# EAGLE design outin_shield_zunda (EAGLE 7.3.0)
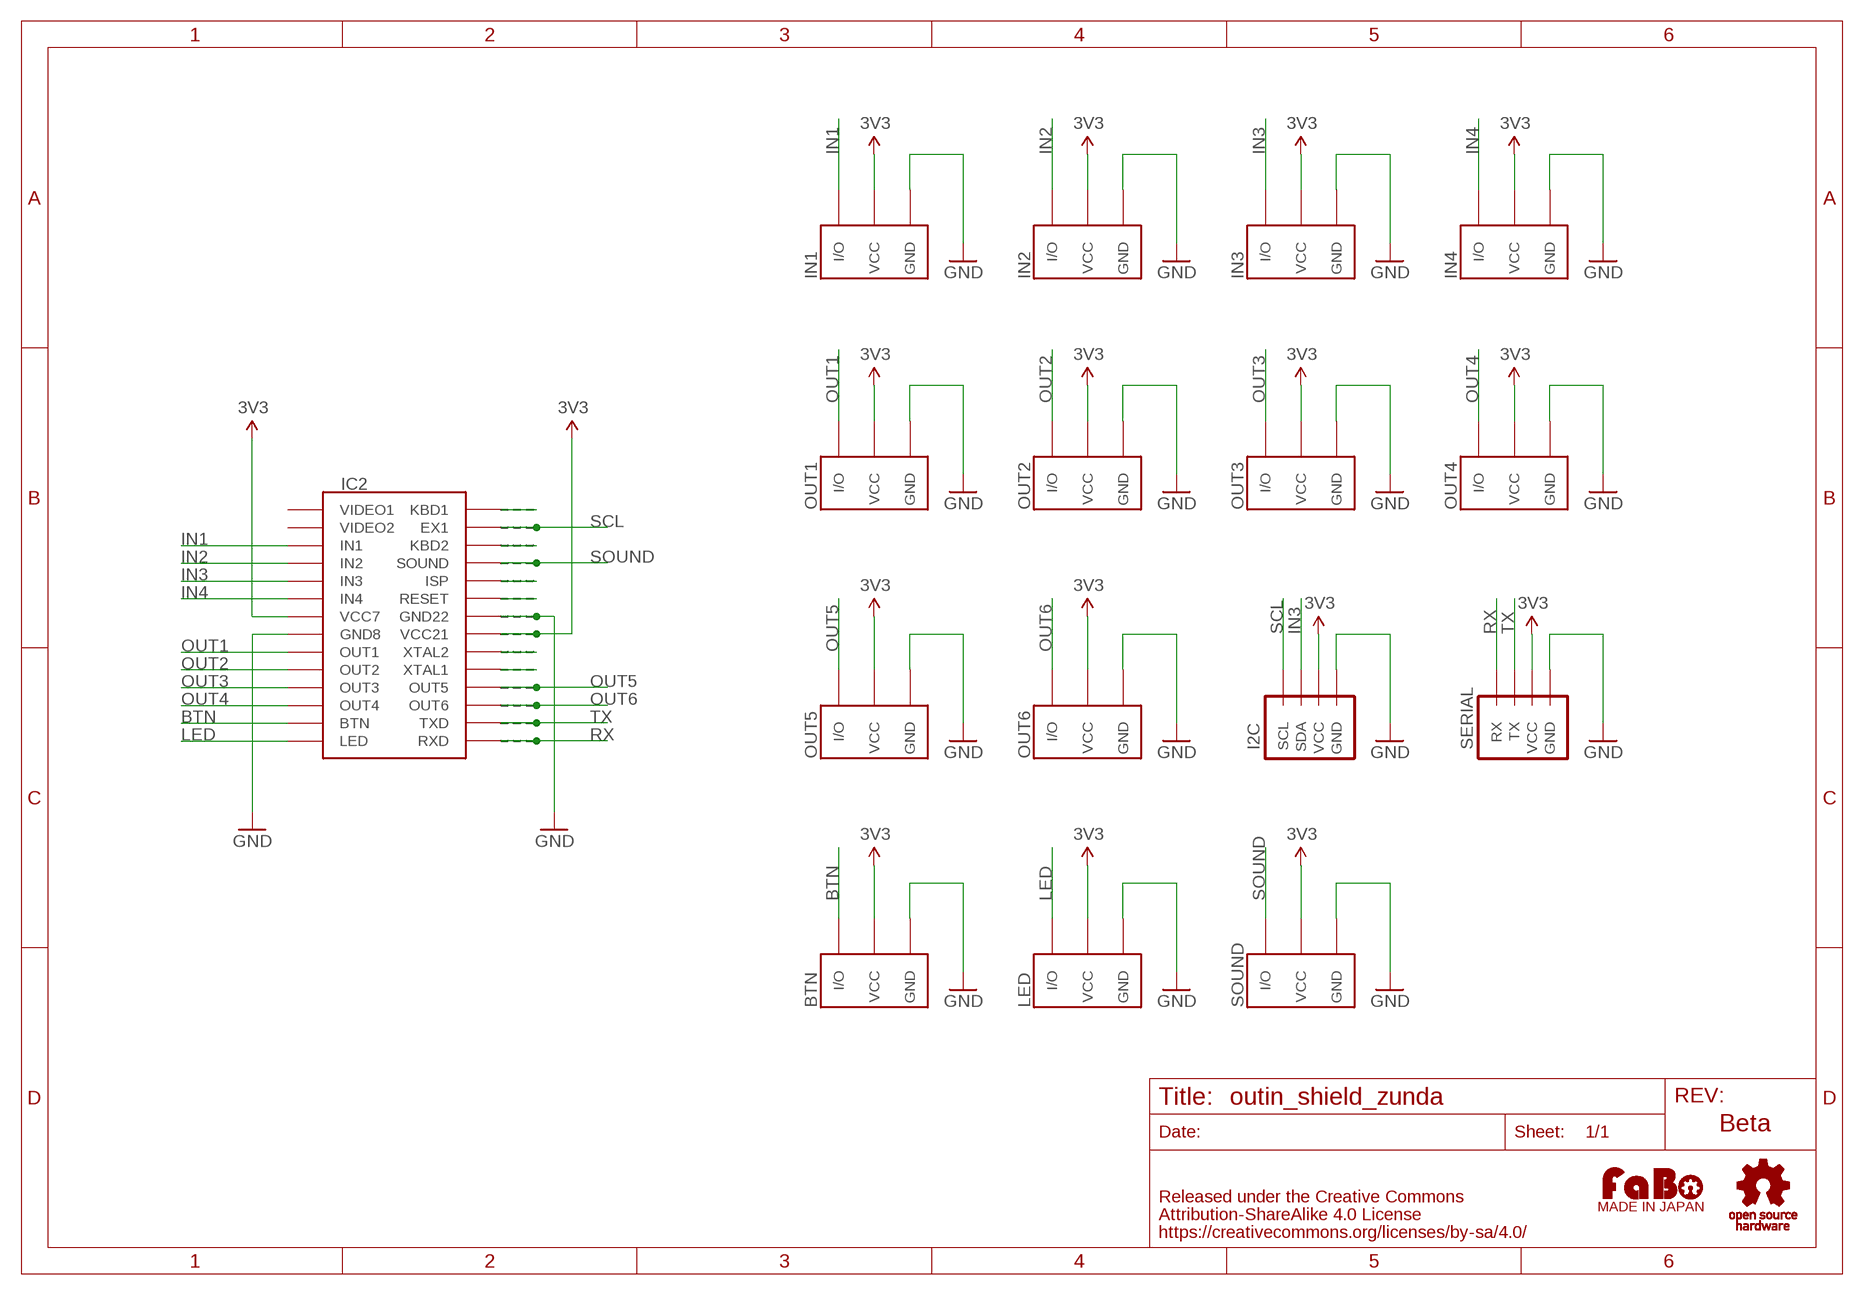
[diagram p0: schematic, sheet 1]

## Parts
BTN  BRICK_3PIN_CONNECTOR  [BRICK_3PIN_CONNECTOR]
I2C  BRICK_I2C_CONNECTOR  [BRICK_I2C_CONNECTOR]
IN1  BRICK_3PIN_CONNECTOR  [BRICK_3PIN_CONNECTOR]
IN2  BRICK_3PIN_CONNECTOR  [BRICK_3PIN_CONNECTOR]
IN3  BRICK_3PIN_CONNECTOR  [BRICK_3PIN_CONNECTOR]
IN4  BRICK_3PIN_CONNECTOR  [BRICK_3PIN_CONNECTOR]
LED  BRICK_3PIN_CONNECTOR  [BRICK_3PIN_CONNECTOR]
OUT1  BRICK_3PIN_CONNECTOR  [BRICK_3PIN_CONNECTOR]
OUT2  BRICK_3PIN_CONNECTOR  [BRICK_3PIN_CONNECTOR]
OUT3  BRICK_3PIN_CONNECTOR  [BRICK_3PIN_CONNECTOR]
OUT4  BRICK_3PIN_CONNECTOR  [BRICK_3PIN_CONNECTOR]
OUT5  BRICK_3PIN_CONNECTOR  [BRICK_3PIN_CONNECTOR]
OUT6  BRICK_3PIN_CONNECTOR  [BRICK_3PIN_CONNECTOR]
SERIAL  BRICK_SERIAL_CONNECTOR  [BRICK_SERIAL_CONNECTOR]
SOUND  BRICK_3PIN_CONNECTOR  [BRICK_3PIN_CONNECTOR]
U$1  ICHIGOJAM-HOLE  [ICHIGOJAM_HOLE]
U$3  LOGO_FABO-M  [LOGO_FABO_M]
U$4  LOGO_OSHW_T-M  [LOGO_OSHW_T_M]

## Nets
3V3: BTN.VCC I2C.VCC IN1.VCC IN2.VCC IN3.VCC IN4.VCC LED.VCC OUT1.VCC OUT2.VCC OUT3.VCC OUT4.VCC OUT5.VCC OUT6.VCC SERIAL.VCC SOUND.VCC U$1.VCC7 U$1.VCC21 U$1.VCC21-2
BTN: BTN.IN/OUT(I/O) U$1.BTN
GND: BTN.GND I2C.GND IN1.GND IN2.GND IN3.GND IN4.GND LED.GND OUT1.GND OUT2.GND OUT3.GND OUT4.GND OUT5.GND OUT6.GND SERIAL.GND SOUND.GND U$1.GND8 U$1.GND22 U$1.GND22-2
IN1: IN1.IN/OUT(I/O) U$1.IN1
IN2: IN2.IN/OUT(I/O) U$1.IN2
IN3: I2C.SDA IN3.IN/OUT(I/O) U$1.IN3
IN4: IN4.IN/OUT(I/O) U$1.IN4
LED: LED.IN/OUT(I/O) U$1.LED
N$5: U$1.KBD1 U$1.KBD1-2
N$6: U$1.KBD2 U$1.KBD2-2
N$7: U$1.ISP U$1.ISP-2
N$8: U$1.RESET U$1.RESET-2
N$9: U$1.XTAL2 U$1.XTAL2-2
N$10: U$1.XTAL1 U$1.XTAL1-2
OUT1: OUT1.IN/OUT(I/O) U$1.OUT1
OUT2: OUT2.IN/OUT(I/O) U$1.OUT2
OUT3: OUT3.IN/OUT(I/O) U$1.OUT3
OUT4: OUT4.IN/OUT(I/O) U$1.OUT4
OUT5: OUT5.IN/OUT(I/O) U$1.OUT5 U$1.OUT5-2
OUT6: OUT6.IN/OUT(I/O) U$1.OUT6 U$1.OUT6-2
RX: SERIAL.RX U$1.RXD U$1.RXD-2
SCL: I2C.SCL U$1.EX1 U$1.EX1-2
SOUND: SOUND.IN/OUT(I/O) U$1.SOUND U$1.SOUND-2
TX: SERIAL.TX U$1.TXD U$1.TXD-2
Unconnected: U$1.VIDEO1 U$1.VIDEO2

## Notes on the sheet
- Beta
- MADE IN JAPAN

## Library data of the parts
BTN IN1-IN4 LED OUT1-OUT6 SOUND = GClue:BRICK_3PIN: FaBo Brick 3pin
I2C = GClue:BRICK_I2C_CONNECTOR: Brick Connector female for OUT/IN Shield
SERIAL = GClue:BRICK_SERIAL_CONNECTOR
U$1 = FaBo:ICHIGOJAM
U$3 = FaBo:LOGO_FABO
U$4 = GClue:LOGO_OSHW_T

## Net classes
0 default: width 0.254 mm

## Board
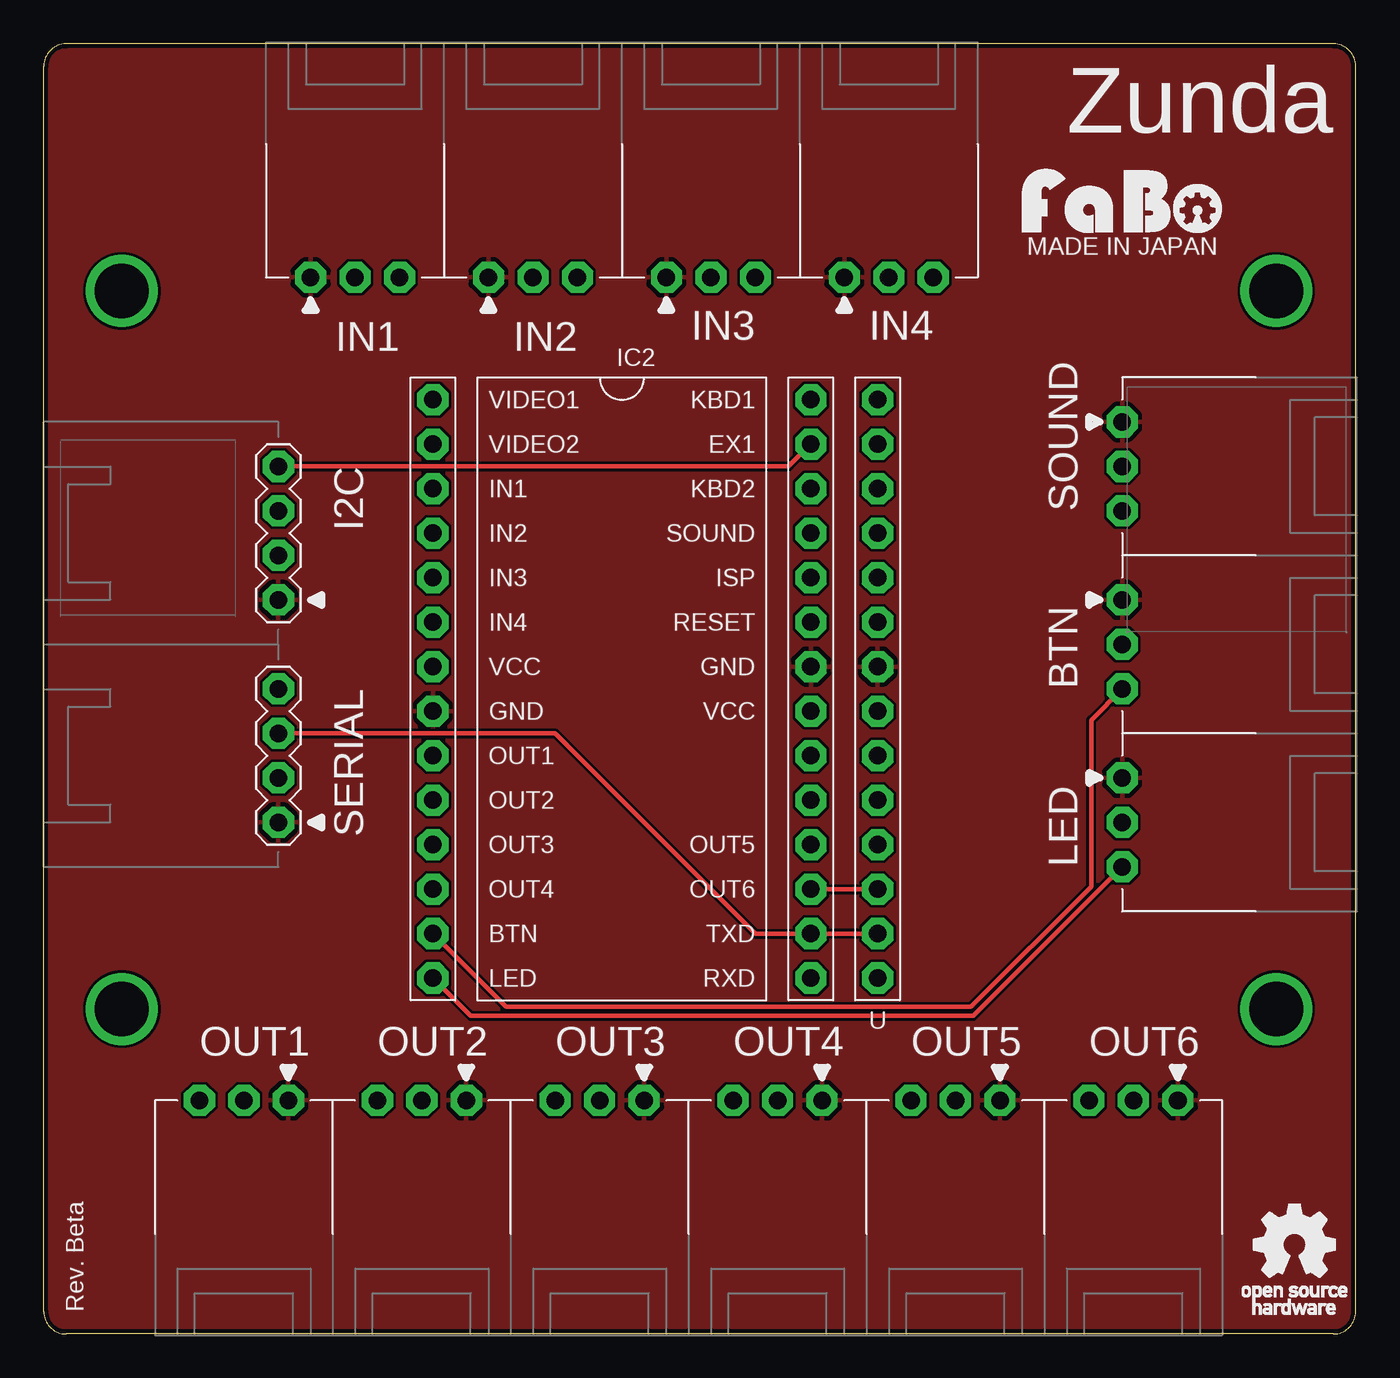
[diagram p1: board, top side]
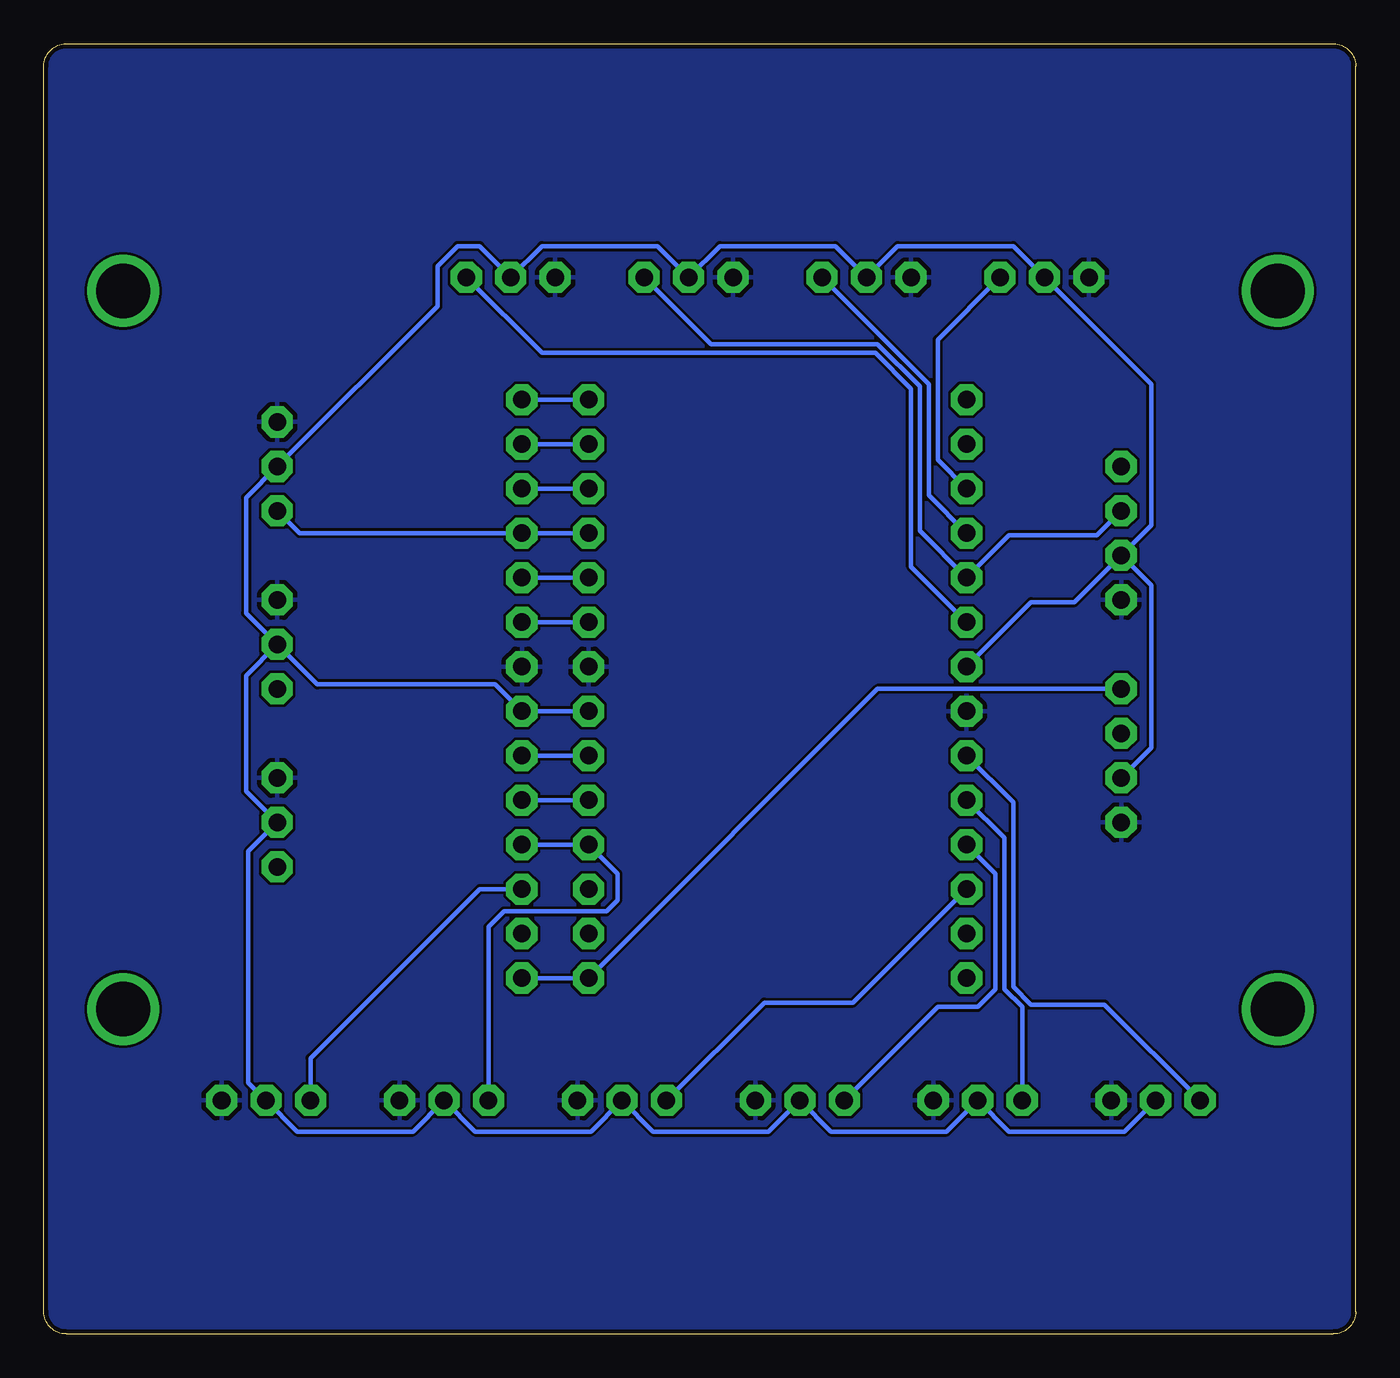
[diagram p2: board, bottom side, seen from below]

Size 74.93 x 73.66 mm. Coordinates in mm from the lower left corner, seen from the top.
Outline: 0,1.27 0,72.39 arc-90 1.27,73.66 73.66,73.66 arc-90 74.93,72.39 74.93,1.27 arc-90 73.66,0 1.27,0 arc-90 0,1.27
Copper layers (1*16): Top 0.035mm / dielectric 1.5mm / Bottom 0.035mm
Design rules "Elecrow_2-layer_eagle_rule": minimum track width 6mil, minimum drill 12mil, track to track 6mil, track to pad 6mil, pad to pad 6mil, via to via 6mil, smd to smd 0mil, copper to edge 10mil, drill to drill 10mil, minimum pad ring 10mil, minimum via ring 6mil, stop-mask expansion 2mil, vias tented up to drill 100mil, thermal gap 10mil

### Footprints (pad centres in the part's own frame; a part is rotated, then mirrored left to right if it is on the bottom)
BRICK_3PIN_CONNECTOR = drill 1 pad 1.778 octagon: GND -2.54,0; IN/OUT 2.54,0; VCC 0,0
BRICK_I2C_CONNECTOR = drill 1 pad 1.778 octagon: GND -3.81,0; SCL 3.81,0; SDA 1.27,0; VCC -1.27,0
BRICK_SERIAL_CONNECTOR = drill 1 pad 1.778 octagon: GND -3.81,0; RX 3.81,0; TX 1.27,0; VCC -1.27,0
ICHIGOJAM_HOLE = drill 1 pad 1.778 octagon: BTN -11.43,-13.97; EX1 10.16,13.97; EX1-2 13.97,13.97; GND8 -11.43,-1.27; GND22 10.16,1.27; GND22-2 13.97,1.27; IN1 -11.43,11.43; IN2 -11.43,8.89; IN3 -11.43,6.35; IN4 -11.43,3.81; ISP 10.16,6.35; ISP-2 13.97,6.35; KBD1 10.16,16.51; KBD1-2 13.97,16.51; KBD2 10.16,11.43; KBD2-2 13.97,11.43; LED -11.43,-16.51; OUT1 -11.43,-3.81; OUT2 -11.43,-6.35; OUT3 -11.43,-8.89; OUT4 -11.43,-11.43; OUT5 10.16,-8.89; OUT5-2 13.97,-8.89; OUT6 10.16,-11.43; OUT6-2 13.97,-11.43; RESET 10.16,3.81; RESET-2 13.97,3.81; RXD 10.16,-16.51; RXD-2 13.97,-16.51; SOUND 10.16,8.89; SOUND-2 13.97,8.89; TXD 10.16,-13.97; TXD-2 13.97,-13.97; VCC7 -11.43,1.27; VCC21 10.16,-1.27; VCC21-2 13.97,-1.27; VIDEO1 -11.43,16.51; VIDEO2 -11.43,13.97; XTAL1 10.16,-6.35; XTAL1-2 13.97,-6.35; XTAL2 10.16,-3.81; XTAL2-2 13.97,-3.81 | drill 3.1: P$1 -29.2,22.72; P$2 36.74,22.72; P$3 36.74,-18.28; P$4 -29.2,-18.28

### Placement (x,y rotation side)
BTN  61.59,39.37 270 top
I2C  13.4,45.72 90 top
IN1  17.78,60.33 0 top
IN2  27.94,60.33 0 top
IN3  38.1,60.33 0 top
IN4  48.26,60.33 0 top
LED  61.59,29.21 270 top
OUT1  11.43,13.34 180 top
OUT2  21.59,13.34 180 top
OUT3  31.75,13.34 180 top
OUT4  41.91,13.34 180 top
OUT5  52.07,13.34 180 top
OUT6  62.23,13.34 180 top
SERIAL  13.4,33.02 90 top
SOUND  61.59,49.53 270 top
U$1  33.66,36.83 0 top
U$3  61.59,62.87 0 top
U$4  71.44,5.08 0 top

### Tracks (layer width: path | path; a pad name or v marks a point on that pad's centre or on a via)
3V3
  Bottom 0.254: U$1.VCC21 U$1.VCC21-2 49.15,37.08 59.31,37.08 BTN.VCC | I2C.VCC 11.68,42.73 11.68,33.47 SERIAL.VCC | I2C.VCC 11.68,46.17 11.68,54.23 IN1.VCC 19.56,62.1 26.16,62.1 IN2.VCC 29.72,62.1 36.32,62.1 IN3.VCC 39.88,62.1 46.48,62.1 IN4.VCC 50.04,62.1 51.31,62.1 52.45,60.96 52.45,58.67 SOUND.VCC 63.37,47.75 63.37,41.15 BTN.VCC | BTN.VCC 63.37,37.59 63.37,30.99 LED.VCC 63.25,27.56 63.25,14.35 OUT6.VCC 60.45,11.56 53.85,11.56 OUT5.VCC 50.29,11.56 43.69,11.56 OUT4.VCC 40.13,11.56 33.53,11.56 OUT3.VCC 29.97,11.56 23.37,11.56 OUT2.VCC 19.81,11.56 13.21,11.56 OUT1.VCC | U$1.VCC7 18.54,41.78 16.07,41.78 I2C.VCC
BTN
  Top 0.254: U$1.BTN 26.42,18.67 52.96,18.67 59.82,25.53 59.82,35.05 BTN.IN/OUT
GND
  pour Bottom: -0.64,-0.64 75.56,-0.64 75.56,74.3 -0.64,74.3
  pour Top: -0.64,-0.64 75.56,-0.64 75.56,74.3 -0.64,74.3
IN1
  Bottom 0.254: U$1.IN1 23.88,49.91 23.88,56.77 IN1.IN/OUT
IN2
  Bottom 0.254: U$1.IN2 24.38,47.88 24.38,54.23 IN2.IN/OUT
IN3
  Bottom 0.254: IN3.IN/OUT 36.83,56.52 27.3,56.52 24.89,54.1 24.89,45.85 U$1.IN3 19.81,45.59 14.8,45.59 I2C.SDA
IN4
  Bottom 0.254: U$1.IN4 25.4,43.81 25.4,53.98 27.43,56.01 46.48,56.01 IN4.IN/OUT
LED
  Top 0.254: U$1.LED 24.38,18.16 53.09,18.16 LED.IN/OUT
N$5
  Bottom 0.254: U$1.KBD1 U$1.KBD1-2
N$6
  Bottom 0.254: U$1.KBD2 U$1.KBD2-2
N$7
  Bottom 0.254: U$1.ISP U$1.ISP-2
N$8
  Bottom 0.254: U$1.RESET U$1.RESET-2
N$9
  Bottom 0.254: U$1.XTAL2 U$1.XTAL2-2
N$10
  Bottom 0.254: U$1.XTAL1 U$1.XTAL1-2
OUT1
  Bottom 0.254: U$1.OUT1 19.56,30.35 19.56,19.81 18.54,18.8 14.35,18.8 OUT1.IN/OUT
OUT2
  Bottom 0.254: U$1.OUT2 20.07,28.32 20.07,19.68 19.05,18.67 OUT2.IN/OUT
OUT3
  Bottom 0.254: U$1.OUT3 20.57,26.29 20.57,19.68 21.59,18.67 23.88,18.67 OUT3.IN/OUT
OUT4
  Bottom 0.254: U$1.OUT4 28.7,18.92 33.78,18.92 OUT4.IN/OUT
OUT5
  Bottom 0.254: U$1.OUT5-2 U$1.OUT5 42.16,26.29 42.16,24.77 42.8,24.13 48.64,24.13 49.53,23.24 OUT5.IN/OUT
OUT6
  Top 0.254: U$1.OUT6 U$1.OUT6-2
  Bottom 0.254: U$1.OUT6-2 50.04,25.4 59.69,15.75 OUT6.IN/OUT
RX
  Bottom 0.254: U$1.RXD-2 U$1.RXD 27.3,36.83 SERIAL.RX
SCL
  Top 0.254: I2C.SCL 42.55,49.53 U$1.EX1
  Bottom 0.254: U$1.EX1 U$1.EX1-2
SOUND
  Bottom 0.254: U$1.SOUND U$1.SOUND-2 60.33,45.72 SOUND.IN/OUT
TX
  Top 0.254: U$1.TXD-2 U$1.TXD 40.64,22.86 29.21,34.29 SERIAL.TX

### Text on the board
tPlace: Zunda | MADE IN JAPAN | Rev. Beta